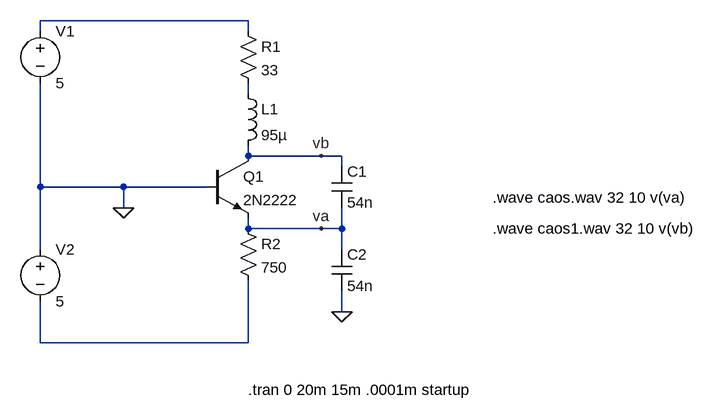
[diagram p0: schematic colpitts caos.asc]
colpitts caos.asc, the LTspice schematic file:
Version 4
SHEET 1 968 680
WIRE 224 -80 -96 -80
WIRE -96 -64 -96 -80
WIRE 224 -64 224 -80
WIRE 224 32 224 16
WIRE 224 128 224 112
WIRE 336 128 224 128
WIRE 368 128 336 128
WIRE 368 144 368 128
WIRE -96 176 -96 16
WIRE 32 176 -96 176
WIRE 160 176 32 176
WIRE 32 208 32 176
WIRE 224 240 224 224
WIRE 336 240 224 240
WIRE 368 240 368 208
WIRE 368 240 336 240
WIRE -96 272 -96 176
WIRE 368 272 368 240
WIRE 368 368 368 336
WIRE -96 416 -96 352
WIRE 224 416 224 320
WIRE 224 416 -96 416
FLAG 368 368 0
FLAG 32 208 0
FLAG 336 240 va
FLAG 336 128 vb
SYMBOL npn 160 128 R0
SYMATTR InstName Q1
SYMATTR Value 2N2222
SYMBOL ind 208 16 R0
SYMATTR InstName L1
SYMATTR Value 95µ
SYMBOL res 208 -80 R0
SYMATTR InstName R1
SYMATTR Value 33
SYMBOL res 208 224 R0
SYMATTR InstName R2
SYMATTR Value 750
SYMBOL cap 352 144 R0
SYMATTR InstName C1
SYMATTR Value 54n
SYMBOL cap 352 272 R0
SYMATTR InstName C2
SYMATTR Value 54n
SYMBOL voltage -96 -80 R0
WINDOW 123 0 0 Left 2
WINDOW 39 0 0 Left 2
SYMATTR InstName V1
SYMATTR Value 5
SYMBOL voltage -96 256 R0
WINDOW 123 0 0 Left 2
WINDOW 39 0 0 Left 2
SYMATTR InstName V2
SYMATTR Value 5
TEXT 224 488 Left 2 !.tran 0 20m 15m .0001m startup
TEXT 600 192 Left 2 !.wave caos.wav 32 10 v(va)
TEXT 600 240 Left 2 !.wave caos1.wav 32 10 v(vb)

The netlist it stands for:
* colpitts caos.asc
Q1 vb 0 va 0 2N2222
L1 N002 vb 95µ
R1 N001 N002 33
R2 va N003 750
C1 vb va 54n
C2 va 0 54n
V1 N001 0 5
V2 0 N003 5
.model NPN NPN
.model PNP PNP
.lib standard.bjt
.tran 0 20m 15m .0001m startup
.wave caos.wav 32 10 v(va)
.wave caos1.wav 32 10 v(vb)
.backanno
.end